# Altium schematic sheet -LM3670_电源.SchDoc
size A4
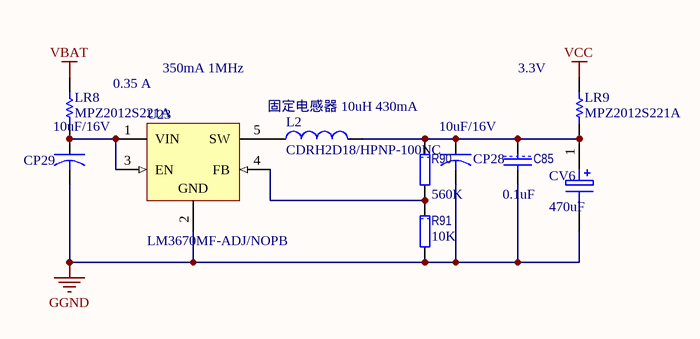
[diagram p0: -LM3670_电源.SchDoc]

## Parts
C85  value 0.1uF  [1608[0603]C]  (hidden comment: C1608X7R1H104K)
CP28  value 10uF/16V  [3216[1206]CB]  (hidden comment: TAJA106K016RNJ)
CP29  value 10uF/16V  [3216[1206]CB]  (hidden comment: TAJA106K016RNJ)
CV6  value 470uF  [CAPPR5-10x20/H1.1]  (hidden comment: EEU-FM1V471)
L2  CDRH2D18/HPNP-100NC  [INDP3232]
LR8  MPZ2012S221A  [2012[0805]]
LR9  MPZ2012S221A  [2012[0805]]
R90  value 560K  [2012[0805]R]  (hidden comment: TNPW0805560KBEEN)
R91  value 10K  [1608[0603]R]  (hidden comment: CRCW060310K0FKEA)
U23  LM3670MF-ADJ/NOPB  输出电流: 0.35 A  [SOT23-5BN]

## Nets
GGND: C85.2 CP28.2 CP29.2 CV6.2 R91.2 U23.2(GND)
VBAT: LR8.2
VCC: LR9.2
NetC85_1: C85.1 CP28.1 CV6.1 L2.2 LR9.1 R90.1
NetCP29_1: CP29.1 LR8.1 U23.1(VIN) U23.3(EN)
NetL2_1: L2.1 U23.5(SW)
NetR90_2: R90.2 R91.1 U23.4(FB)

## Notes on the sheet
- 350mA 1MHz
- (near LR9) 3.3V

## Library data of the parts
C85 = CAP: 多层陶瓷电容器MLCC - SMD/SMT 0603 0.1uF 50volts X7R 10%; Manufacturer: TDK; 产品: General Type MLCCs; 产品种类: Low & Medium Capacitance SMD Ceramic Chip Capacitors; 外壳代码 - in: 0603; 外壳代码 - mm: 1608; 封装 / 箱体: 0603 (1608 metric); 封装: Reel; 尺寸: 0.8 mm W x 1.6 mm L x 0.8 mm H; 工作温度范围: - 55 C to + 125 C; 标准包装数量: 4000; 电压额定值: 50 V; 电容-nF: 100 nF; 电容-pF: 100000 pF; 系列: C; Category: 多层陶瓷电容器MLCC - SMD/SMT; ComponentLink1Description: http://www.tdk.com/pdf/general_B11.pdf; ComponentLink1URL: http://www.tdk.com/pdf/general_B11.pdf; Description 1: 多层陶瓷电容器MLCC - SMD/SMT 0603 0.1uF 50volts X7R 10%; Manufacturer Part Number: C1608X7R1H104K; Minimum Order Quantity: 1; Pricing 1: 1=0.160, 50=0.070, 100=0.036, 500=0.019, 1000=0.013, 4000=0.010, 8000=0.009, 12000=0.008, 20000=0.007 (USD); Reeling: True; RoHS - 贸泽: Y; RoHS: RoHS Compliant; Stock 1: 224604; Supplier 1: Mouser; Supplier Part Number 1: 810-C1608X7R1H104K; 制造商: TDK; 容差: 10 %; 温度系数/代码: X7R; 电容: 0.1 uF; 端接类型: SMD/SMT
CP28 CP29 = CAPACITOR: 钽质电容器-固体SMD 16volts 10uF 10%; Manufacturer: AVX; ESR: 3 Ohms; 产品: Tantalum Solid Standard Grade - Other Various; 产品种类: SMD Tantalum Capacitors; 制造商库存号: A Case; 外壳代码 - in: 1206; 外壳代码 - mm: 3216; 封装 / 箱体: 1206 (3216 metric); 封装: Reel; 尺寸: 1.6 mm W x 3.2 mm L; 工作温度范围: - 55 C to + 125 C; 损耗因数 DF: 8; 标准包装数量: 2000; 漏泄电流: 1.6 uA; 电压额定值: 16 V; 端接类型: SMD/SMT; 系列: TAJ; 高度: 1.8 mm; Category: 钽质电容器-固体SMD; ComponentLink1Description: http://www.avx.com/docs/Catalogs/taj.pdf; ComponentLink1URL: http://www.avx.com/docs/Catalogs/taj.pdf; Description 1: 钽质电容器-固体SMD 16volts 10uF 10%; Manufacturer Part Number: TAJA106K016RNJ; Minimum Order Quantity: 1; Pricing 1: 1=0.600, 100=0.280, 200=0.250, 500=0.221, 1000=0.200, 2000=0.140, 5000=0.131, 10000=0.124, 25000=0.103 (USD); Reeling: True; RoHS - 贸泽: Y; RoHS: RoHS Compliant; Stock 1: 20335; Supplier 1: Mouser; Supplier Part Number 1: 581-TAJA106K016R; 制造商: AVX; 容差: 10 %; 电容: 10 uF
CV6 = ELECTRO1: 插针 铝质电解电容器 - 带引线 470UF 35V ELECT FM RADIAL; Manufacturer: Panasonic Electronic Components; 工作温度范围: - 40 C to + 105 C; 封装: Bulk; 产品: General Purpose Electrolytic Capacitors; 容差: 20 %; 外壳直径: 10 mm; 外壳长度: 20 mm; 引线间隔: 5 mm; 制造商: Panasonic; 标准包装数量: 200; Supplier 1: Mouser; Supplier Part Number 1: 667-EEU-FM1V471; Manufacturer Part Number: EEU-FM1V471; RoHS: RoHS Compliant; Description 1: 铝质电解电容器 - 带引线 470UF 35V ELECT FM RADIAL; Category: 铝质电解电容器 - 带引线; Stock 1: 8429; Pricing 1: 1=0.300, 25=0.281, 100=0.258, 250=0.238, 500=0.230, 1000=0.226, 2000=0.216, 5000=0.200 (USD); 电容: 470 uF; 系列: FM; 端接类型: Radial; 电压额定值: 35 V; RoHS - 贸泽: Y; Minimum Order Quantity: 1; Reeling: False; ComponentLink1URL: http://www.mouser.com/ds/2/315/ABA0000CE108-5973.pdf; ComponentLink1Description: http://www.mouser.com/ds/2/315/ABA0000CE108-5973.pdf
L2 = Inductor: 固定电感器 10uH 430mA; Manufacturer: Sumida; 尺寸: 3.2 mm W x 3.2 mm L x 2 mm H; 最大直流电流: 0.85 A; 最大直流电阻: 245 mOhms; 封装: Reel; 产品: SMD Power Inductor; 系列: CDRH; 屏蔽: Shielded; 端接类型: SMD/SMT; 容差: 30 %; 外壳高度: 2 mm; 外壳长度: 3.2 mm; 产品种类: SMD Power Inductors Shielded; 标准包装数量: 1000; 测试频率: 100 kHz; Supplier 1: Mouser; Supplier Part Number 1: 851-CDRH2D18HP-100NC; Manufacturer Part Number: CDRH2D18/HPNP-100NC; RoHS: RoHS Compliant; Description 1: 固定电感器 10uH 430mA; Category: 固定电感器; Stock 1: 1271; Pricing 1: 1=0.810, 10=0.650, 100=0.590, 500=0.540, 1000=0.490, 5000=0.450, 10000=0.410, 25000=0.370 (USD); 电感: 10 uH; 外壳宽度: 3.2 mm; 制造商: Sumida; RoHS - 贸泽: Y; Minimum Order Quantity: 1; Reeling: True; ComponentLink1URL: http://www.mouser.com/ds/2/390/cdrh2d18hp-189473.pdf; ComponentLink1Description: http://www.mouser.com/ds/2/390/cdrh2d18hp-189473.pdf; Value: 10uH
LR8 LR9 = Res Semi: 电磁干扰滤波珠子、扼流圈和阵列 Ferrite Chip Beads; Manufacturer: TDK; 阻抗: 220 Ohms; 最大直流电流: 3 A; 最大直流电阻: 0.04 Ohms; 工作温度范围: - 55 C to + 125 C; 封装 / 箱体: 2012; 封装: Reel; 端接类型: SMD/SMT; 容差: 25 %; 产品种类: Ferrite Beads; 标准包装数量: 4000; Supplier 1: Mouser; Supplier Part Number 1: 810-MPZ2012S221A; Manufacturer Part Number: MPZ2012S221A; RoHS: RoHS Compliant; Description 1: 电磁干扰滤波珠子、扼流圈和阵列 Ferrite Chip Beads; Category: 电磁干扰滤波珠子、扼流圈和阵列; Stock 1: 26540; Pricing 1: 1=0.070, 50=0.060, 100=0.053, 500=0.040, 1000=0.035, 4000=0.031, 8000=0.029, 12000=0.025 (USD); 制造商: TDK; RoHS - 贸泽: Y; Minimum Order Quantity: 1; Reeling: True; ComponentLink1URL: http://www.mouser.com/ds/2/400/e9413_mpz-24582.pdf; ComponentLink1Description: http://www.mouser.com/ds/2/400/e9413_mpz-24582.pdf
R90 = RES: 薄膜电阻器 - SMD 560K  OHM  .1% 25PPM; Manufacturer: Vishay; 尺寸: 1.25 mm W x 2 mm L x 0.45 mm H; 工作温度范围: - 55 C to + 155 C; 封装 / 箱体: 0805 (2012 metric); 封装: Reel - 7 in; 功率额定值: 125 mW (1/8 W); 产品: Precision Resistors Thin Film SMD; 电阻: 560 kOhms; 系列: TNPW; 温度系数: 25 PPM / K; 端接类型: SMD/SMT; 容差: 0.1 %; 电压额定值: 150 V; 外壳高度: 0.45 mm; 外壳长度: 2 mm; 外壳宽度: 1.25 mm; 标准包装数量: 1000; Supplier 1: Mouser; Supplier Part Number 1: N/A; Manufacturer Part Number: TNPW0805560KBEEN; RoHS: RoHS Compliant; Description 1: 薄膜电阻器 - SMD 560K  OHM  .1% 25PPM; Category: 薄膜电阻器 - SMD; Stock 1: 0; 制造商: Vishay; Minimum Order Quantity: 1; Reeling: True; ComponentLink1URL: http://www.vishay.com/doc?28758; ComponentLink1Description: http://www.vishay.com/doc?28758
R91 = RES: 厚膜电阻器 - SMD 1/10watt 10Kohms 1%; Manufacturer: Vishay / Dale; 尺寸: 0.85 mm W x 1.55 mm L x 0.45 mm H; 工作温度范围: - 55 C to + 155 C; 封装 / 箱体: 0603 (1608 metric); 封装: Reel; 功率额定值: 100 mW; 产品: Thick Film Resistors SMD; 系列: CRCW; 温度系数: 100 PPM / K; 端接类型: SMD/SMT; 电压额定值: 75 V; 制造商: Vishay; 产品种类: 0603 Thick Film Chip Resistors; 标准包装数量: 5000; 外壳代码 - in: 0603; 外壳代码 - mm: 1608; Supplier 1: Mouser; Supplier Part Number 1: 71-CRCW0603-10K-E3; Manufacturer Part Number: CRCW060310K0FKEA; RoHS: RoHS Compliant By Exemption; Category: 厚膜电阻器 - SMD; Stock 1: 0; Pricing 1: 1=0.080, 10=0.013, 100=0.010, 1000=0.008, 5000=0.005, 25000=0.004, 50000=0.003 (USD); 电阻: 10 kOhms; 容差: 1 %; RoHS - 贸泽: E; Minimum Order Quantity: 1; Reeling: True; ComponentLink1URL: http://www.mouser.com/ds/2/427/dcrcwe3-109170.pdf; ComponentLink1Description: http://www.mouser.com/ds/2/427/dcrcwe3-109170.pdf; Description 1: 厚膜电阻器 - SMD 1/10watt 10Kohms 1%
U23 = LM3670MF-3.3/NOPB: DC/DC 开关控制器 Mini SD DC-DC Cnvtr; Manufacturer: Texas Instruments; 输入电压: 5.5 V; 输出端数量: 1; 输出电压: 0.7 V to 3.3 V; 封装 / 箱体: SOT-23; 封装: Reel; 系列: LM3670; 安装风格: SMD/SMT; 开关频率: 1000 KHz; 最大工作温度: + 85 C; 最小工作温度: - 40 C; 标准包装数量: 1000; Product Status: New at Mouser; Supplier 1: Mouser; Supplier Part Number 1: 926-LM3670MFADJNOPB; Manufacturer Part Number: LM3670MF-ADJ/NOPB; RoHS: RoHS Compliant; Description 1: DC/DC 开关控制器 Mini SD DC-DC Cnvtr; Category: DC/DC 开关控制器; Stock 1: 2498; Pricing 1: 1=0.730, 10=0.607, 25=0.540, 50=0.509, 100=0.364, 250=0.358, 500=0.351, 750=0.344, 1000=0.338 (USD); 制造商: Texas Instruments; RoHS - 贸泽: Y; Minimum Order Quantity: 1; Reeling: True; ComponentLink1URL: http://www.mouser.com/ds/2/282/snvs250d-123118.pdf; ComponentLink1Description: http://www.mouser.com/ds/2/282/snvs250d-123118.pdf